# Altium schematic sheet [6]-MCU_CONNECTORS.SchDoc
size A4
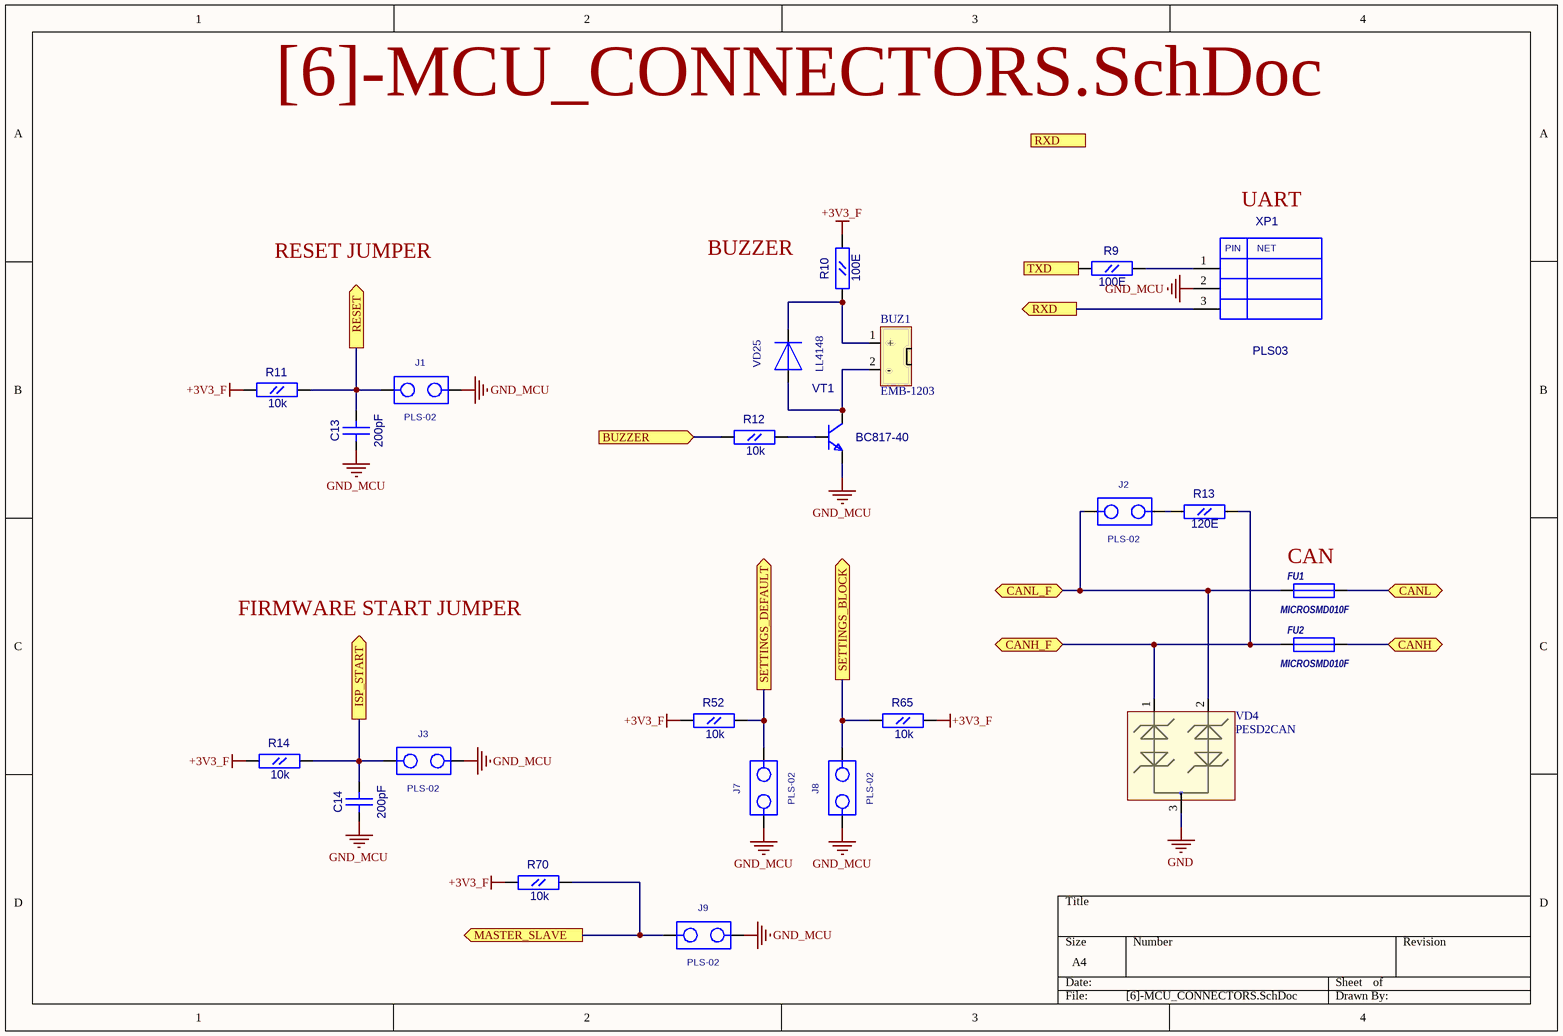
[diagram p0: [6]-MCU_CONNECTORS.SchDoc]

## Parts
BUZ1  EMB-1203  [BUZZER_12]
C13  200pF  [CC0603]
C14  200pF  [CC0603]
FU1  MICROSMD010F  [RC1210]
FU2  MICROSMD010F  [RC1210]
J1  PLS-02  [PLS-02]
J2  PLS-02  [PLS-02]
J3  PLS-02  [PLS-02]
J7  PLS-02  [PLS-02]
J8  PLS-02  [PLS-02]
J9  PLS-02  [PLS-02]
R9  100E  [RC0603]
R10  100E  [RC0603]
R11  10k  [RC0603]
R12  10k  [RC0603]
R13  120E  [RC0805]
R14  10k  [RC0603]
R52  10k  [RC0603]
R65  10k  [RC0603]
R70  10k  [RC0603]
VD4  PESD2CAN  [SOT-23(123)]
VD25  LL4148  [SOD-80]
VT1  BC817-40  [SOT-23(123)]
XP1  PLS03  [PLS-03]

## Ports
BUZZER (in), CANH (bidir), CANH_F (bidir), CANL (bidir), CANL_F (bidir), ISP_START (out), MASTER_SLAVE (out), RESET (out), RXD (out), SETTINGS_BLOCK (out), SETTINGS_DEFAULT (out), TXD (out)

## Nets
+3V3_F: R10.2(B) R11.1(A) R14.1(A) R52.1(A) R65.2(B) R70.1(A)
GND: VD4.3
GND_MCU: C13.1(A) C14.1(A) J1.2 J3.2 J7.1 J8.1 J9.2 VT1.2(E) XP1.2
BUZZER: R12.1(A) ; port BUZZER
CANH: FU2.2 ; port CANH
CANH_F: FU2.1 R13.2(B) VD4.1 ; port CANH_F
CANL: FU1.2 ; port CANL
CANL_F: FU1.1 J2.1 VD4.2 ; port CANL_F
ISP_START: C14.2(B) J3.1 R14.2(B) ; port ISP_START
MASTER_SLAVE: J9.1 R70.2(B) ; port MASTER_SLAVE
RESET: C13.2(B) J1.1 R11.2(B) ; port RESET
RXD: XP1.3 ; port RXD
SETTINGS_BLOCK: J8.2 R65.1(A) ; port SETTINGS_BLOCK
SETTINGS_DEFAULT: J7.2 R52.2(B) ; port SETTINGS_DEFAULT
TXD: R9.1(A) ; port TXD
NetBUZ1_1: BUZ1.1(+) R10.1(A) VD25.2(+)
NetBUZ1_2: BUZ1.2(-) VD25.1(-) VT1.3(C)
NetJ2_2: J2.2 R13.1(A)
NetR9_2: R9.2(B) XP1.1
NetR12_2: R12.2(B) VT1.1(B)

## Notes on the sheet
- UART
- RESET JUMPER
- BUZZER
- (near FU1) CAN
- FIRMWARE START JUMPER
- (in symbol PLS03) PIN; NET

## Library data of the parts
BUZ1 = EMB-1203: Buzzer diameter 12mm 3V; Value: EMB-1203
C13 C14 = CC0603: Value: 200pF
FU1 FU2 = MICROSMD: Value: *
R9-R12 R14 R52 R65 R70 = RC0603
  R9 R10: Value: 100E
  R11 R12 R14 R52 R65 R70: Value: 10k
R13 = RC0805: Value: 120E
VD4 = PESD2CAN: TVS for CAN
VT1 = BC846BLT1: NPN 500ma transistor; ComponentField7: Published 29-Sep-2000; OriginalName: BC846BLT1; Value: BC817-40
J1-J3 J7-J9 = PLS-02: Value: *
VD25 = LL4148: Value: *
XP1 = PLS03: Value: *